# Altium schematic sheet POWER.SchDoc
size B
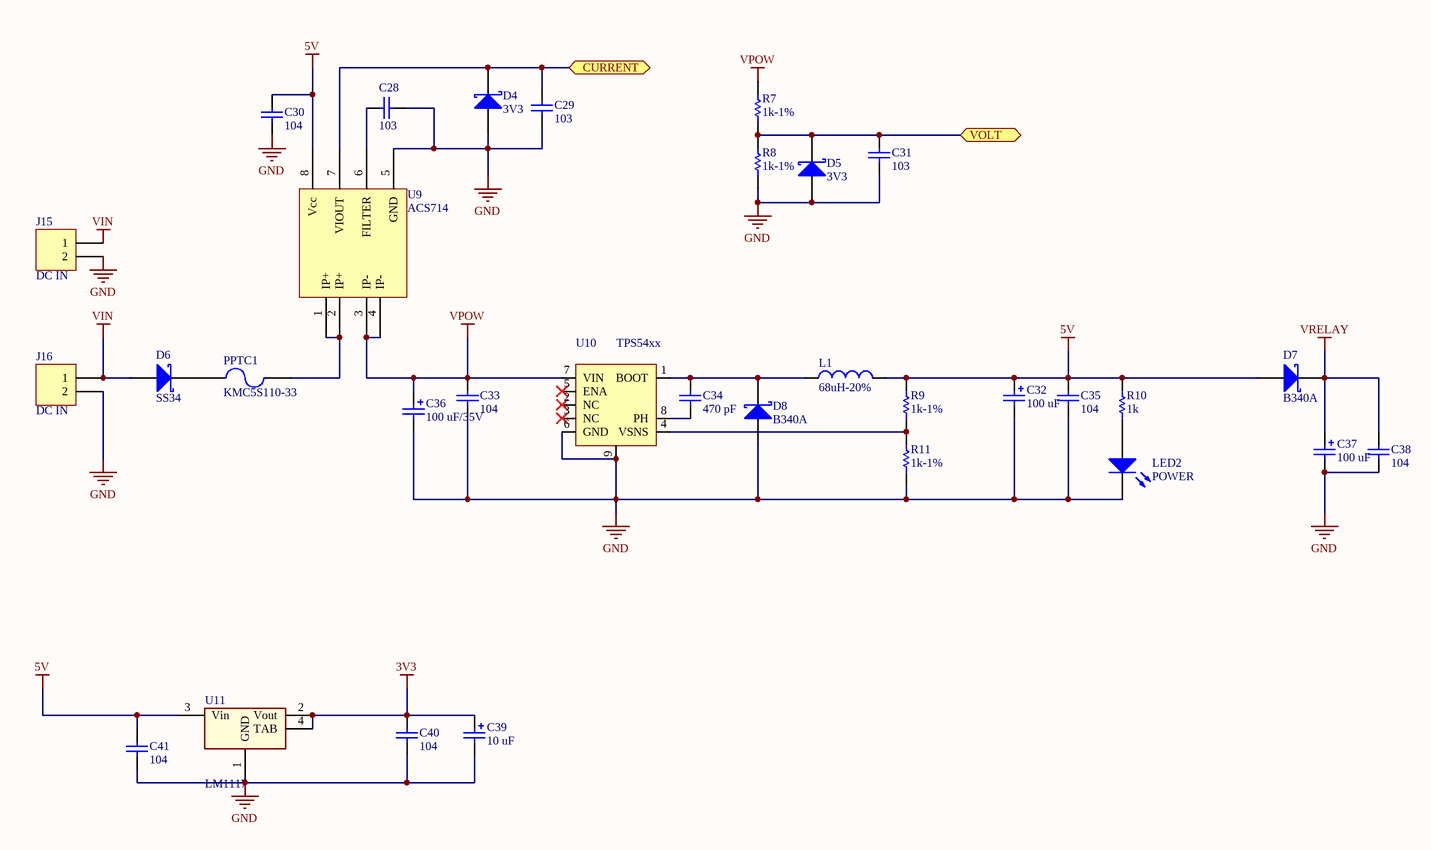
[diagram p0: POWER.SchDoc]

## Parts
C28  103  [C0603]
C29  103  [C0603]
C30  104  [C0603]
C31  103  [C0603]
C32  100 uF  [CAP_TANTA_SMD_100UF/16V]
C33  104  [C0603]
C34  470 pF  [C0603]
C35  104  [C0603]
C36  100 uF/35V  [CAP_AL_SMD (10X10.2)]
C37  100 uF  [CAP_TANTA_SMD_100UF/16V]
C38  104  [C0603]
C39  10 uF  [CAP_TANTA_SMD_100UF/16V]
C40  104  [C0603]
C41  104  [C0603]
D4  3V3  [DO_213AA]
D5  3V3  [DO_213AA]
D6  SS34  [DO-214AC (SMA)]
D7  B340A  [DO-214AC (SMA)]
D8  B340A  [DO-214AC (SMA)]
J15  DC IN  [DOMINO NORMAL 2]
J16  DC IN  [DOMINO NORMAL 2]
L1  68uH-20%  [L10.4W10.4H4.8]
LED2  POWER  [SM/LED_0603]
PPTC1  KMC5S110-33  [PTC1812]
R7  1k-1%  [R0603]
R8  1k-1%  [R0603]
R9  1k-1%  [R0603]
R10  1k  [R0603]
R11  1k-1%  [R0603]
U9  ACS714  [SOIC-8N]
U10  TPS54xx  [HSOIOCN]
U11  LM1117  [SOT223_L]

## Ports
CURRENT, VOLT

## Nets
3V3: C39.1 C40.2 U11.2(Vout) U11.4(TAB)
5V: C30.2 C32.1 C35.2 C41.2 D7.1(A) L1.2 R9.2 R10.2 U9.8(Vcc) U11.3(Vin)
GND: C28.1 C29.1 C30.1 C31.1 C32.2 C33.2 C35.1 C36.2 C37.2 C38.1 C39.2 C40.1 C41.1 D4.1(A) D5.1(A) D8.1(A) J15.2 J16.2 LED2.2(K) R8.1 R11.1 U9.5(GND) U10.6(GND) U10.9(G-PAD) U11.1(GND)
VIN: D6.1(A) J15.1 J16.1
VPOW: C33.1 C36.1 R7.2 U9.3(IP-) U9.4(IP-) U10.7(VIN)
VRELAY: C37.1 C38.2 D7.2(K)
CURRENT: C29.2 D4.2(K) U9.7(VIOUT) ; port CURRENT
VOLT: C31.2 D5.2(K) R7.1 R8.2 ; port VOLT
NetC28_2: C28.2 U9.6(FILTER)
NetC34_1: C34.1 U10.8(PH)
NetC34_2: C34.2 D8.2(K) L1.1 U10.1(BOOT)
NetD6_2: D6.2(K) PPTC1.1
NetLED2_1: LED2.1(A) R10.1
NetPPTC1_2: PPTC1.2 U9.1(IP+) U9.2(IP+)
NetR9_1: R9.1 R11.2 U10.4(VSNS)

Not connected (* = marked no-connect by the designer): U10 2(NC)* 3(NC)* 5(ENA)*

## Library data of the parts
C28-C31 C33-C35 C38 C40 C41 = Cap_SMT: CAP CER 0.1UF 16V Y5V 0402; Manufacturer: Yageo; Manufacturer Part Number: CC0603ZRY5V7BB104; Published: 8-Jun-2000; LatestRevisionDate: 17-Jul-2002; LatestRevisionNote: Re-released for DXP Platform.; PackageReference: C0603; Publisher: Altium Limited; Digi-Key Part Number: 311-1047-1-ND; Unit Price: 0.00648
  C28 C29 C31: Value: 103
  C30 C33 C35 C38 C40 C41: Value: 104
  C34: Value: 470 pF
C32 C37 C39 = Cap_TANTA: CAP TANTA
C36 = Cap_ALU: CAP ALU
D4-D8 = D Schottky: DIODE SCHOTTKY 40V 3A SMA; Manufacturer Part Number: B340A-E3/61T; Manufacturer: Vishay General Semiconductor; Published: 8-Jun-2000; LatestRevisionDate: 17-Jul-2002; LatestRevisionNote: Re-released for DXP Platform.; PackageReference: DO-214-AA; Publisher: Altium Limited; Code_JEDEC: DO-214-AA; Unit Price: 0.15840; Digi-Key Part Number: B340A-E3/61TGITR-ND
J15 J16 = Header 2: Header, 2-Pin; LatestRevisionDate: 17-Jul-2002; LatestRevisionNote: Re-released for DXP Platform.; Publisher: Altium Limited
L1 = Inductor: INDUCTOR POWER 68UH SMD; Manufacturer: Abracon Corporation; Manufacturer Part Number: ASPI-6045S-680M-T; Code_IEC: 1005; Published: 8-Jun-2000; LatestRevisionDate: 29-May-2009; LatestRevisionNote: IPC-7351 Footprint Added.; PackageReference: 0402-A; Publisher: Altium Limited; PackageDescription: Chip Inductor; Code_JEITA: 0402; Digi-Key Part Number: ASPI-6045S-680M-TTR-ND; Unit Price: 0.22500; Value: 68uH-20%
LED2 = LED: LED GREEN 0.2MM 13MCD 0402 SMD; Manufacturer: Lite-On Inc; Manufacturer Part Number: LTST-C191KGKT; Published: 8-Jun-2000; LatestRevisionDate: 17-Jul-2002; LatestRevisionNote: Re-released for DXP Platform.; PackageVersion: Feb-2002; PackageReference: 3.2X1.6X1.1; Publisher: Altium Limited; Digi-Key Part Number: 511-1592-2-ND; Unit Price: 0.03780; Value: LED GREEN
PPTC1 = Fuse 2: POLYSWITCH .50A RESET FUSE SMD; Manufacturer: TE Connectivity; Manufacturer Part Number: MINISMDC050F-2; Value: MINISMDC050F-2; Published: 8-Jun-2000; LatestRevisionDate: 17-Jul-2002; LatestRevisionNote: Re-released for DXP Platform.; PackageReference: PIN-W2/E2.8; Publisher: Altium Limited; Digi-Key Part Number: MINISMDC050FCT-ND; Unit Price: 0.17304
R7-R9 R11 = R_SMD1: Resistor SMD 1%; Manufacturer: Panasonic Electronic Components; Manufacturer Part Number: ERJ-2RKF3241X; Published: 8-Jun-2000; LatestRevisionDate: 17-Jul-2002; LatestRevisionNote: Re-released for DXP Platform.; PackageReference: R0603; Publisher: Altium Limited; Digi-Key Part Number: P3.24KLTR-ND; Unit Price: 0.00203; Value: 1k-1%
R10 = R_SMD5: Resistor SMD 5%; Manufacturer: Panasonic Electronic Components; Manufacturer Part Number: ERJ-2RKF3241X; Published: 8-Jun-2000; LatestRevisionDate: 17-Jul-2002; LatestRevisionNote: Re-released for DXP Platform.; PackageReference: R0603; Publisher: Altium Limited; Digi-Key Part Number: P3.24KLTR-ND; Unit Price: 0.00203; Value: 1k
U9 = ACS714: AutomotiveHall Effect-Based Linear Current Sensor
U10 = TPS54xx: IC REG BUCK ADJ 1A 8SOIC; Manufacturer: Texas Instruments; Manufacturer Part Number: TPS5410DR; Unit Price: 1.6; Digi-Key Part Number: 296-26988-2-ND